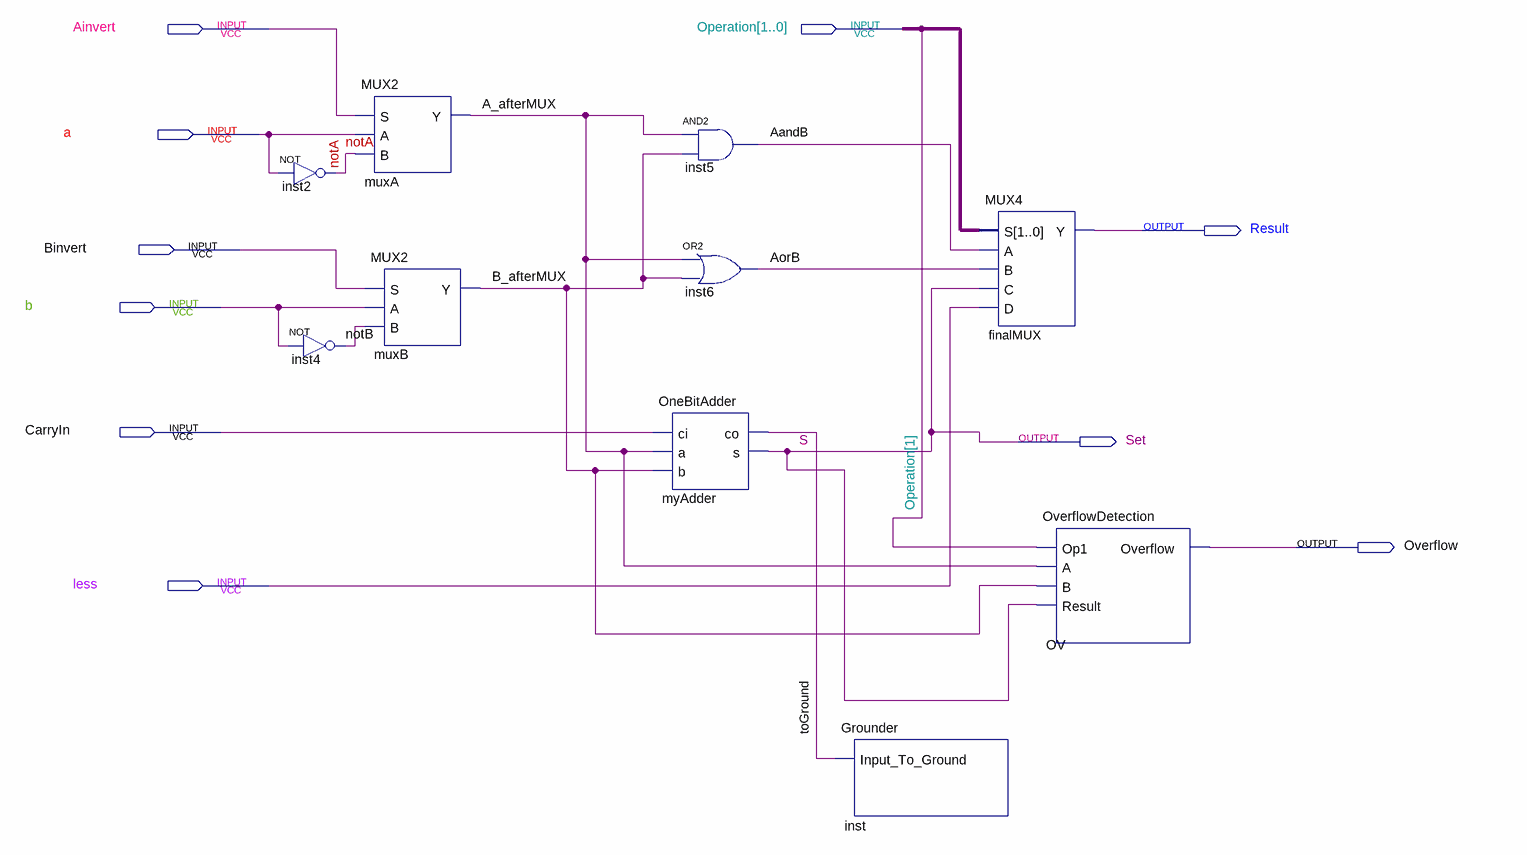
[diagram p0: schematic sheet]
// Quartus schematic ALUBit31.bdf as structural Verilog: 10 symbols, 10 pins
module ALUBit31 (
  input  Ainvert,
  input  [1:0] Operation,
  input  a,
  input  Binvert,
  input  b,
  input  CarryIn,
  input  less,
  output Result,
  output Set,
  output Overflow
);

  wire A_afterMUX, AandB, AorB, B_afterMUX, notA, notB, toGround;

  not inst2 (notA, a);
  not inst4 (notB, b);
  MUX2 muxA (.S(Ainvert), .A(a), .B(notA), .Y(A_afterMUX));
  MUX2 muxB (.S(Binvert), .A(b), .B(notB), .Y(B_afterMUX));
  and inst5 (AandB, A_afterMUX, B_afterMUX);
  or inst6 (AorB, A_afterMUX, B_afterMUX);
  OneBitAdder myAdder (.ci(CarryIn), .a(A_afterMUX), .b(B_afterMUX), .co(toGround), .s(Set));
  Grounder inst (.Input_To_Ground(toGround));
  MUX4 finalMUX (.S(Operation), .A(AandB), .B(AorB), .C(Set), .D(less), .Y(Result));
  OverflowDetection OV (.Op1(Operation[1]), .A(A_afterMUX), .B(B_afterMUX), .Result(Set), .Overflow(Overflow));

  // Other names for the same wires on the sheet: S = Set
endmodule
